# EAGLE schematic 74273_output_port (EAGLE 7.2.0)
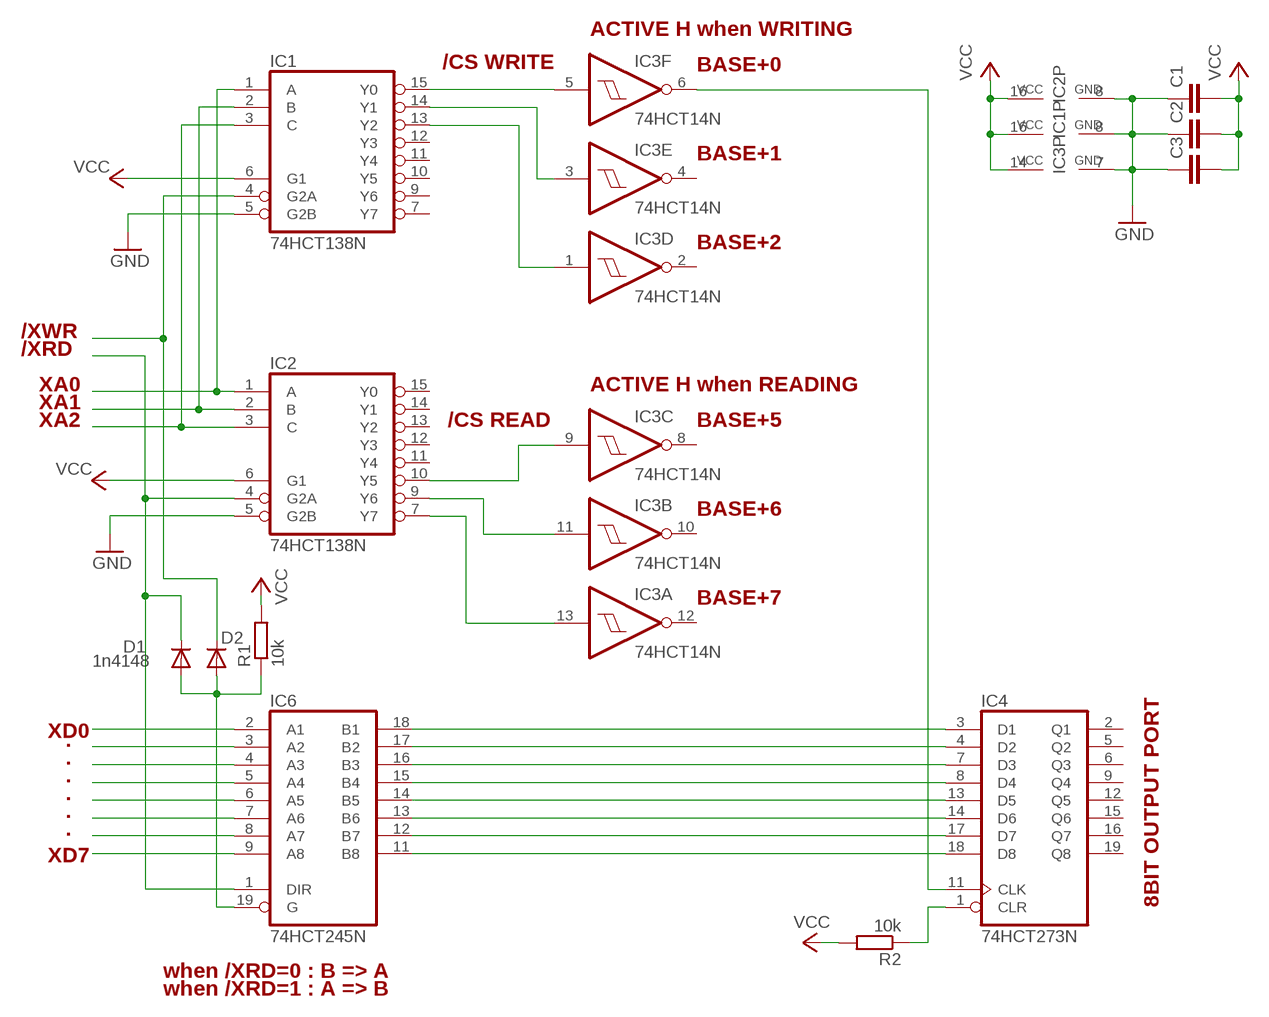
[diagram p0: schematic, sheet 1]

## Parts
C1  C-EU025-024X044  [C025-024X044]
C2  C-EU025-024X044  [C025-024X044]
C3  C-EU025-024X044  [C025-024X044]
D1  1n4148  GF1  [SMA-DO214AC]
D2  GF1  [SMA-DO214AC]
IC1  74HCT138N  [DIL16]
IC2  74HCT138N  [DIL16]
IC3  74HCT14N  [DIL14]
IC4  74HCT273N  [DIL20]
IC6  74HCT245N  74LS245N  [DIL20]
R1  10k  R-EU_0204/5  [0204/5]
R2  10k  R-EU_0204/5  [0204/5]

## Nets
GND: C1.1 C2.1 C3.1 IC1.5(G2B) IC1.8(GND) IC2.5(G2B) IC2.8(GND) IC3.7(P:GND)
N$1: IC1.1(A) IC2.1(A)
N$2: IC1.2(B) IC2.2(B)
N$3: IC1.3(C) IC2.3(C)
N$4: IC2.7(Y7) IC3.13(A:I)
N$5: IC2.9(Y6) IC3.11(B:I)
N$6: IC1.15(Y0) IC3.5(F:I)
N$7: IC1.14(Y1) IC3.3(E:I)
N$8: IC1.13(Y2) IC3.1(D:I)
N$9: IC2.10(Y5) IC3.9(C:I)
N$10: D1.K(C) IC2.4(G2A) IC6.1(DIR)
N$11: D2.K(C) IC1.4(G2A)
N$12: D1.A D2.A IC6.19(G) R1.1
N$13: IC4.3(D1) IC6.18(B1)
N$14: IC4.4(D2) IC6.17(B2)
N$15: IC4.7(D3) IC6.16(B3)
N$16: IC4.8(D4) IC6.15(B4)
N$17: IC4.13(D5) IC6.14(B5)
N$18: IC4.14(D6) IC6.13(B6)
N$19: IC4.17(D7) IC6.12(B7)
N$20: IC4.18(D8) IC6.11(B8)
N$21: IC4.1(CLR) R2.1
N$22: IC3.6(F:O) IC4.11(CLK)
VCC: C1.2 C2.2 C3.2 IC1.6(G1) IC1.16(VCC) IC2.6(G1) IC2.16(VCC) IC3.14(P:VCC) R1.2 R2.2
XD0: IC6.2(A1)
XD1: IC6.3(A2)
XD2: IC6.4(A3)
XD3: IC6.5(A4)
XD4: IC6.6(A5)
XD5: IC6.7(A6)
XD6: IC6.8(A7)
XD7: IC6.9(A8)
Unconnected: IC1.7(Y7) IC1.9(Y6) IC1.10(Y5) IC1.11(Y4) IC1.12(Y3) IC2.11(Y4) IC2.12(Y3) IC2.13(Y2) IC2.14(Y1) IC2.15(Y0) IC3.2(D:O) IC3.4(E:O) IC3.8(C:O) IC3.10(B:O) IC3.12(A:O) IC4.2(Q1) IC4.5(Q2) IC4.6(Q3) IC4.9(Q4) IC4.12(Q5) IC4.15(Q6) IC4.16(Q7) IC4.19(Q8)

## Notes on the sheet
- ACTIVE H when WRITING
- /CS WRITE
- BASE+0
- BASE+1
- BASE+2
- /XWR
- /XRD
- XA0 | ACTIVE H when READING
- XA1
- XA2 | /CS READ | BASE+5
- BASE+6
- BASE+7
- XD0
- .
- .
- .
- .
- .
- .
- XD7
- 8BIT OUTPUT PORT
- when /XRD=0 : B => A
- when /XRD=1 : A => B

## Power pins joined to a net without a drawn wire
GND: IC4.10(GND) IC6.10(GND)
VCC: IC4.20(VCC) IC6.20(VCC)

## Library data of the parts
C1-C3 = rcl:C-EU: CAPACITOR, European symbol
D1 D2 = diode:GF1: DIODE
IC1 IC2 = 74xx-eu:74*138: 3-line to 8-line DECODER/DEMULTIPLEXER
IC3 = 74xx-eu:74*14: Hex schmitt trigger INVERTER
IC4 = 74xx-eu:74*273: Octal D type FLIP FLOP, clear
IC6 = 74xx-us:74*245: Octal BUS TRANSCEIVER, 3-state
R1 R2 = rcl:R-EU_: RESISTOR, European symbol